# Altium schematic sheet 03.RK3399 Power.SchDoc
size A3; SheetNumber: 3; SheetTotal: 10
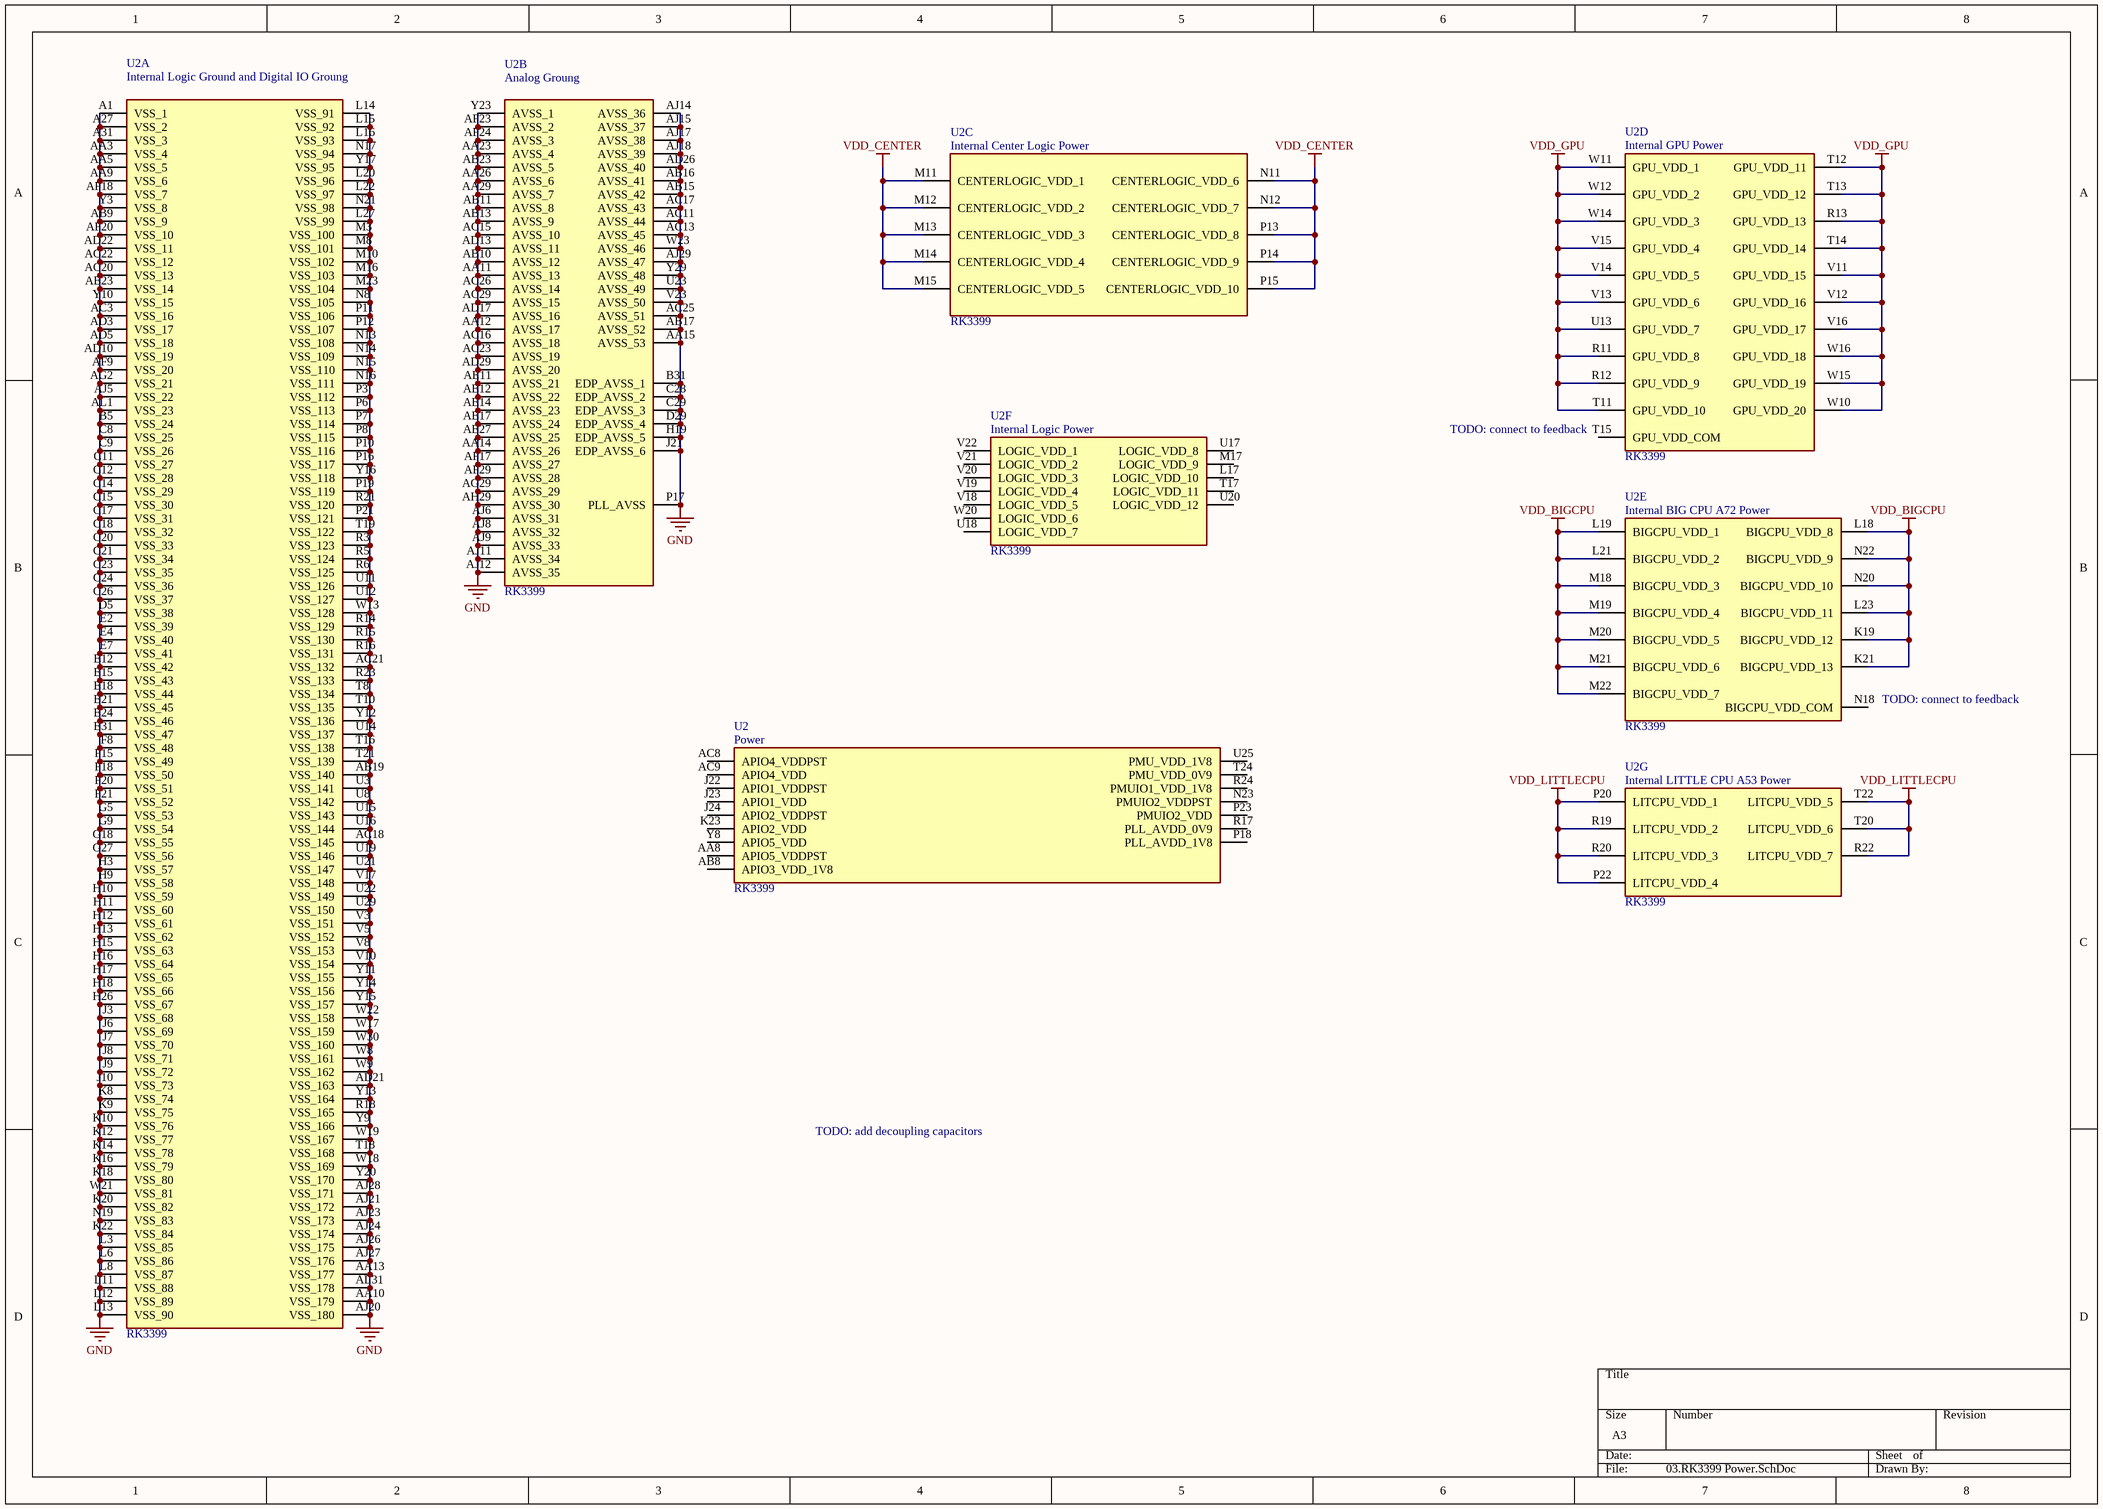
[diagram p0: 03.RK3399 Power.SchDoc]

## Parts
U2  RK3399  [BGA828C65P31X31_2100X2100X161N]  (parts A,B,C,D,E,F,G,29 of 32)

## Nets
GND: U2.A1(VSS_1) U2.A27(VSS_2) U2.A31(VSS_3) U2.AA3(VSS_4) U2.AA5(VSS_5) U2.AA9(VSS_6) U2.AA10(VSS_179) U2.AA11(AVSS_13) U2.AA12(AVSS_17) U2.AA13(VSS_177) U2.AA14(AVSS_26) U2.AA15(AVSS_53) U2.AA23(AVSS_4) U2.AA26(AVSS_6) U2.AA29(AVSS_7) U2.AB9(VSS_9) U2.AB10(AVSS_12) U2.AB11(AVSS_8) U2.AB13(AVSS_9) U2.AB15(AVSS_42) U2.AB16(AVSS_41) U2.AB17(AVSS_52) U2.AB19(VSS_140) U2.AB23(AVSS_5) U2.AC3(VSS_16) U2.AC11(AVSS_44) U2.AC13(AVSS_45) U2.AC15(AVSS_10) U2.AC16(AVSS_18) U2.AC17(AVSS_43) U2.AC18(VSS_145) U2.AC20(VSS_13) U2.AC21(VSS_132) U2.AC22(VSS_12) U2.AC23(AVSS_19) U2.AC25(AVSS_51) U2.AC26(AVSS_14) U2.AC29(AVSS_15) U2.AD3(VSS_17) U2.AD5(VSS_18) U2.AD10(VSS_19) U2.AD13(AVSS_11) U2.AD17(AVSS_16) U2.AD21(VSS_163) U2.AD22(VSS_11) U2.AD26(AVSS_40) U2.AD29(AVSS_20) U2.AE11(AVSS_21) U2.AE12(AVSS_22) U2.AE14(AVSS_23) U2.AE17(AVSS_24) U2.AE23(VSS_14) U2.AE27(AVSS_25) U2.AF9(VSS_20) U2.AF17(AVSS_27) U2.AF18(VSS_7) U2.AF20(VSS_10) U2.AF23(AVSS_2) U2.AF24(AVSS_3) U2.AF29(AVSS_28) U2.AG2(VSS_21) U2.AG29(AVSS_29) U2.AH29(AVSS_30) U2.AJ5(VSS_22) U2.AJ6(AVSS_31) U2.AJ8(AVSS_32) U2.AJ9(AVSS_33) U2.AJ11(AVSS_34) U2.AJ12(AVSS_35) U2.AJ14(AVSS_36) U2.AJ15(AVSS_37) U2.AJ17(AVSS_38) U2.AJ18(AVSS_39) U2.AJ20(VSS_180) U2.AJ21(VSS_172) U2.AJ23(VSS_173) U2.AJ24(VSS_174) U2.AJ26(VSS_175) U2.AJ27(VSS_176) U2.AJ28(VSS_171) U2.AJ29(AVSS_47) U2.AL1(VSS_23) U2.AL31(VSS_178) U2.B5(VSS_24) U2.B31(EDP_AVSS_1) U2.C8(VSS_25) U2.C9(VSS_26) U2.C11(VSS_27) U2.C12(VSS_28) U2.C14(VSS_29) U2.C15(VSS_30) U2.C17(VSS_31) U2.C18(VSS_32) U2.C20(VSS_33) U2.C21(VSS_34) U2.C23(VSS_35) U2.C24(VSS_36) U2.C26(VSS_37) U2.C28(EDP_AVSS_2) U2.C29(EDP_AVSS_3) U2.D5(VSS_38) U2.D29(EDP_AVSS_4) U2.E2(VSS_39) U2.E4(VSS_40) U2.E7(VSS_41) U2.E12(VSS_42) U2.E15(VSS_43) U2.E18(VSS_44) U2.E21(VSS_45) U2.E24(VSS_46) U2.E31(VSS_47) U2.F8(VSS_48) U2.F15(VSS_49) U2.F18(VSS_50) U2.F20(VSS_51) U2.F21(VSS_52) U2.G5(VSS_53) U2.G9(VSS_54) U2.G18(VSS_55) U2.G27(VSS_56) U2.H3(VSS_57) U2.H9(VSS_58) U2.H10(VSS_59) U2.H11(VSS_60) U2.H12(VSS_61) U2.H13(VSS_62) U2.H15(VSS_63) U2.H16(VSS_64) U2.H17(VSS_65) U2.H18(VSS_66) U2.H19(EDP_AVSS_5) U2.H26(VSS_67) U2.J3(VSS_68) U2.J6(VSS_69) U2.J7(VSS_70) U2.J8(VSS_71) U2.J9(VSS_72) U2.J10(VSS_73) U2.J21(EDP_AVSS_6) U2.K8(VSS_74) U2.K9(VSS_75) U2.K10(VSS_76) U2.K12(VSS_77) U2.K14(VSS_78) U2.K16(VSS_79) U2.K18(VSS_80) U2.K20(VSS_82) U2.K22(VSS_84) U2.L3(VSS_85) U2.L6(VSS_86) U2.L8(VSS_87) U2.L11(VSS_88) U2.L12(VSS_89) U2.L13(VSS_90) U2.L14(VSS_91) U2.L15(VSS_92) U2.L16(VSS_93) U2.L20(VSS_96) U2.L22(VSS_97) U2.L27(VSS_99) U2.M3(VSS_100) U2.M8(VSS_101) U2.M10(VSS_102) U2.M16(VSS_103) U2.M23(VSS_104) U2.N8(VSS_105) U2.N13(VSS_108) U2.N14(VSS_109) U2.N15(VSS_110) U2.N16(VSS_111) U2.N17(VSS_94) U2.N19(VSS_83) U2.N21(VSS_98) U2.P3(VSS_112) U2.P6(VSS_113) U2.P7(VSS_114) U2.P8(VSS_115) U2.P10(VSS_116) U2.P11(VSS_106) U2.P12(VSS_107) U2.P16(VSS_117) U2.P17(PLL_AVSS) U2.P19(VSS_119) U2.P21(VSS_121) U2.R3(VSS_123) U2.R5(VSS_124) U2.R6(VSS_125) U2.R14(VSS_129) U2.R15(VSS_130) U2.R16(VSS_131) U2.R18(VSS_165) U2.R21(VSS_120) U2.R23(VSS_133) U2.T8(VSS_134) U2.T10(VSS_135) U2.T16(VSS_138) U2.T18(VSS_168) U2.T19(VSS_122) U2.T21(VSS_139) U2.U3(VSS_141) U2.U8(VSS_142) U2.U11(VSS_126) U2.U12(VSS_127) U2.U14(VSS_137) U2.U15(VSS_143) U2.U16(VSS_144) U2.U19(VSS_146) U2.U21(VSS_147) U2.U22(VSS_149) U2.U23(AVSS_49) U2.U29(VSS_150) U2.V3(VSS_151) U2.V5(VSS_152) U2.V8(VSS_153) U2.V10(VSS_154) U2.V17(VSS_148) U2.V23(AVSS_50) U2.W8(VSS_161) U2.W9(VSS_162) U2.W13(VSS_128) U2.W17(VSS_159) U2.W18(VSS_169) U2.W19(VSS_167) U2.W21(VSS_81) U2.W22(VSS_158) U2.W23(AVSS_46) U2.W30(VSS_160) U2.Y3(VSS_8) U2.Y9(VSS_166) U2.Y10(VSS_15) U2.Y11(VSS_155) U2.Y12(VSS_136) U2.Y13(VSS_164) U2.Y14(VSS_156) U2.Y15(VSS_157) U2.Y16(VSS_118) U2.Y17(VSS_95) U2.Y20(VSS_170) U2.Y23(AVSS_1) U2.Y29(AVSS_48)
VDD_BIGCPU: U2.K19(BIGCPU_VDD_12) U2.K21(BIGCPU_VDD_13) U2.L18(BIGCPU_VDD_8) U2.L19(BIGCPU_VDD_1) U2.L21(BIGCPU_VDD_2) U2.L23(BIGCPU_VDD_11) U2.M18(BIGCPU_VDD_3) U2.M19(BIGCPU_VDD_4) U2.M20(BIGCPU_VDD_5) U2.M21(BIGCPU_VDD_6) U2.M22(BIGCPU_VDD_7) U2.N20(BIGCPU_VDD_10) U2.N22(BIGCPU_VDD_9)
VDD_CENTER: U2.M11(CENTERLOGIC_VDD_1) U2.M12(CENTERLOGIC_VDD_2) U2.M13(CENTERLOGIC_VDD_3) U2.M14(CENTERLOGIC_VDD_4) U2.M15(CENTERLOGIC_VDD_5) U2.N11(CENTERLOGIC_VDD_6) U2.N12(CENTERLOGIC_VDD_7) U2.P13(CENTERLOGIC_VDD_8) U2.P14(CENTERLOGIC_VDD_9) U2.P15(CENTERLOGIC_VDD_10)
VDD_GPU: U2.R11(GPU_VDD_8) U2.R12(GPU_VDD_9) U2.R13(GPU_VDD_13) U2.T11(GPU_VDD_10) U2.T12(GPU_VDD_11) U2.T13(GPU_VDD_12) U2.T14(GPU_VDD_14) U2.U13(GPU_VDD_7) U2.V11(GPU_VDD_15) U2.V12(GPU_VDD_16) U2.V13(GPU_VDD_6) U2.V14(GPU_VDD_5) U2.V15(GPU_VDD_4) U2.V16(GPU_VDD_17) U2.W10(GPU_VDD_20) U2.W11(GPU_VDD_1) U2.W12(GPU_VDD_2) U2.W14(GPU_VDD_3) U2.W15(GPU_VDD_19) U2.W16(GPU_VDD_18)
VDD_LITTLECPU: U2.P20(LITCPU_VDD_1) U2.P22(LITCPU_VDD_4) U2.R19(LITCPU_VDD_2) U2.R20(LITCPU_VDD_3) U2.R22(LITCPU_VDD_7) U2.T20(LITCPU_VDD_6) U2.T22(LITCPU_VDD_5)

Not connected (* = marked no-connect by the designer): U2 AA8(APIO5_VDDPST) AB8(APIO3_VDD_1V8) AC8(APIO4_VDDPST) AC9(APIO4_VDD) J22(APIO1_VDDPST) J23(APIO1_VDD) J24(APIO2_VDDPST) K23(APIO2_VDD) L17(LOGIC_VDD_10) M17(LOGIC_VDD_9) N18(BIGCPU_VDD_COM) N23(PMUIO2_VDDPST) P18(PLL_AVDD_1V8) P23(PMUIO2_VDD) R17(PLL_AVDD_0V9) R24(PMUIO1_VDD_1V8) T15(GPU_VDD_COM) T17(LOGIC_VDD_11) T24(PMU_VDD_0V9) U17(LOGIC_VDD_8) U18(LOGIC_VDD_7) U20(LOGIC_VDD_12) U25(PMU_VDD_1V8) V18(LOGIC_VDD_5) V19(LOGIC_VDD_4) V20(LOGIC_VDD_3) V21(LOGIC_VDD_2) V22(LOGIC_VDD_1) W20(LOGIC_VDD_6) Y8(APIO5_VDD)

## Notes on the sheet
- (near U2) TODO: connect to feedback
- TODO: add decoupling capacitors
- (in symbol RK3399, part A) Internal Logic Ground and Digital IO Groung
- (in symbol RK3399, part B) Analog Groung
- (in symbol RK3399, part C) Internal Center Logic Power
- (in symbol RK3399, part D) Internal GPU Power
- (in symbol RK3399, part E) Internal BIG CPU A72 Power
- (in symbol RK3399, part F) Internal Logic Power
- (in symbol RK3399, part G) Internal LITTLE CPU A53 Power
- (in symbol RK3399, part 29) Power

## Library data of the parts
U2 = RK3399: RK3399 ROCK Pi 4 Model A 2GB - ARMÂ® CortexÂ®-A53, CortexÂ®-A72 MPU Embedded Evaluation Board; MF: Rockchip; SnapEDA_Link: https://www.snapeda.com/parts/RK3399/Fuzhou+Rockchip+Electronics+Co/view-part/?ref=snap; Package: Seeed Technology; MP: RK3399; Check_prices: https://www.snapeda.com/parts/RK3399/Fuzhou+Rockchip+Electronics+Co/view-part/?ref=eda; Price: None; Value: *; Availability: Not in stock